# EAGLE design kicker-v2.1 (EAGLE 6.5.0)
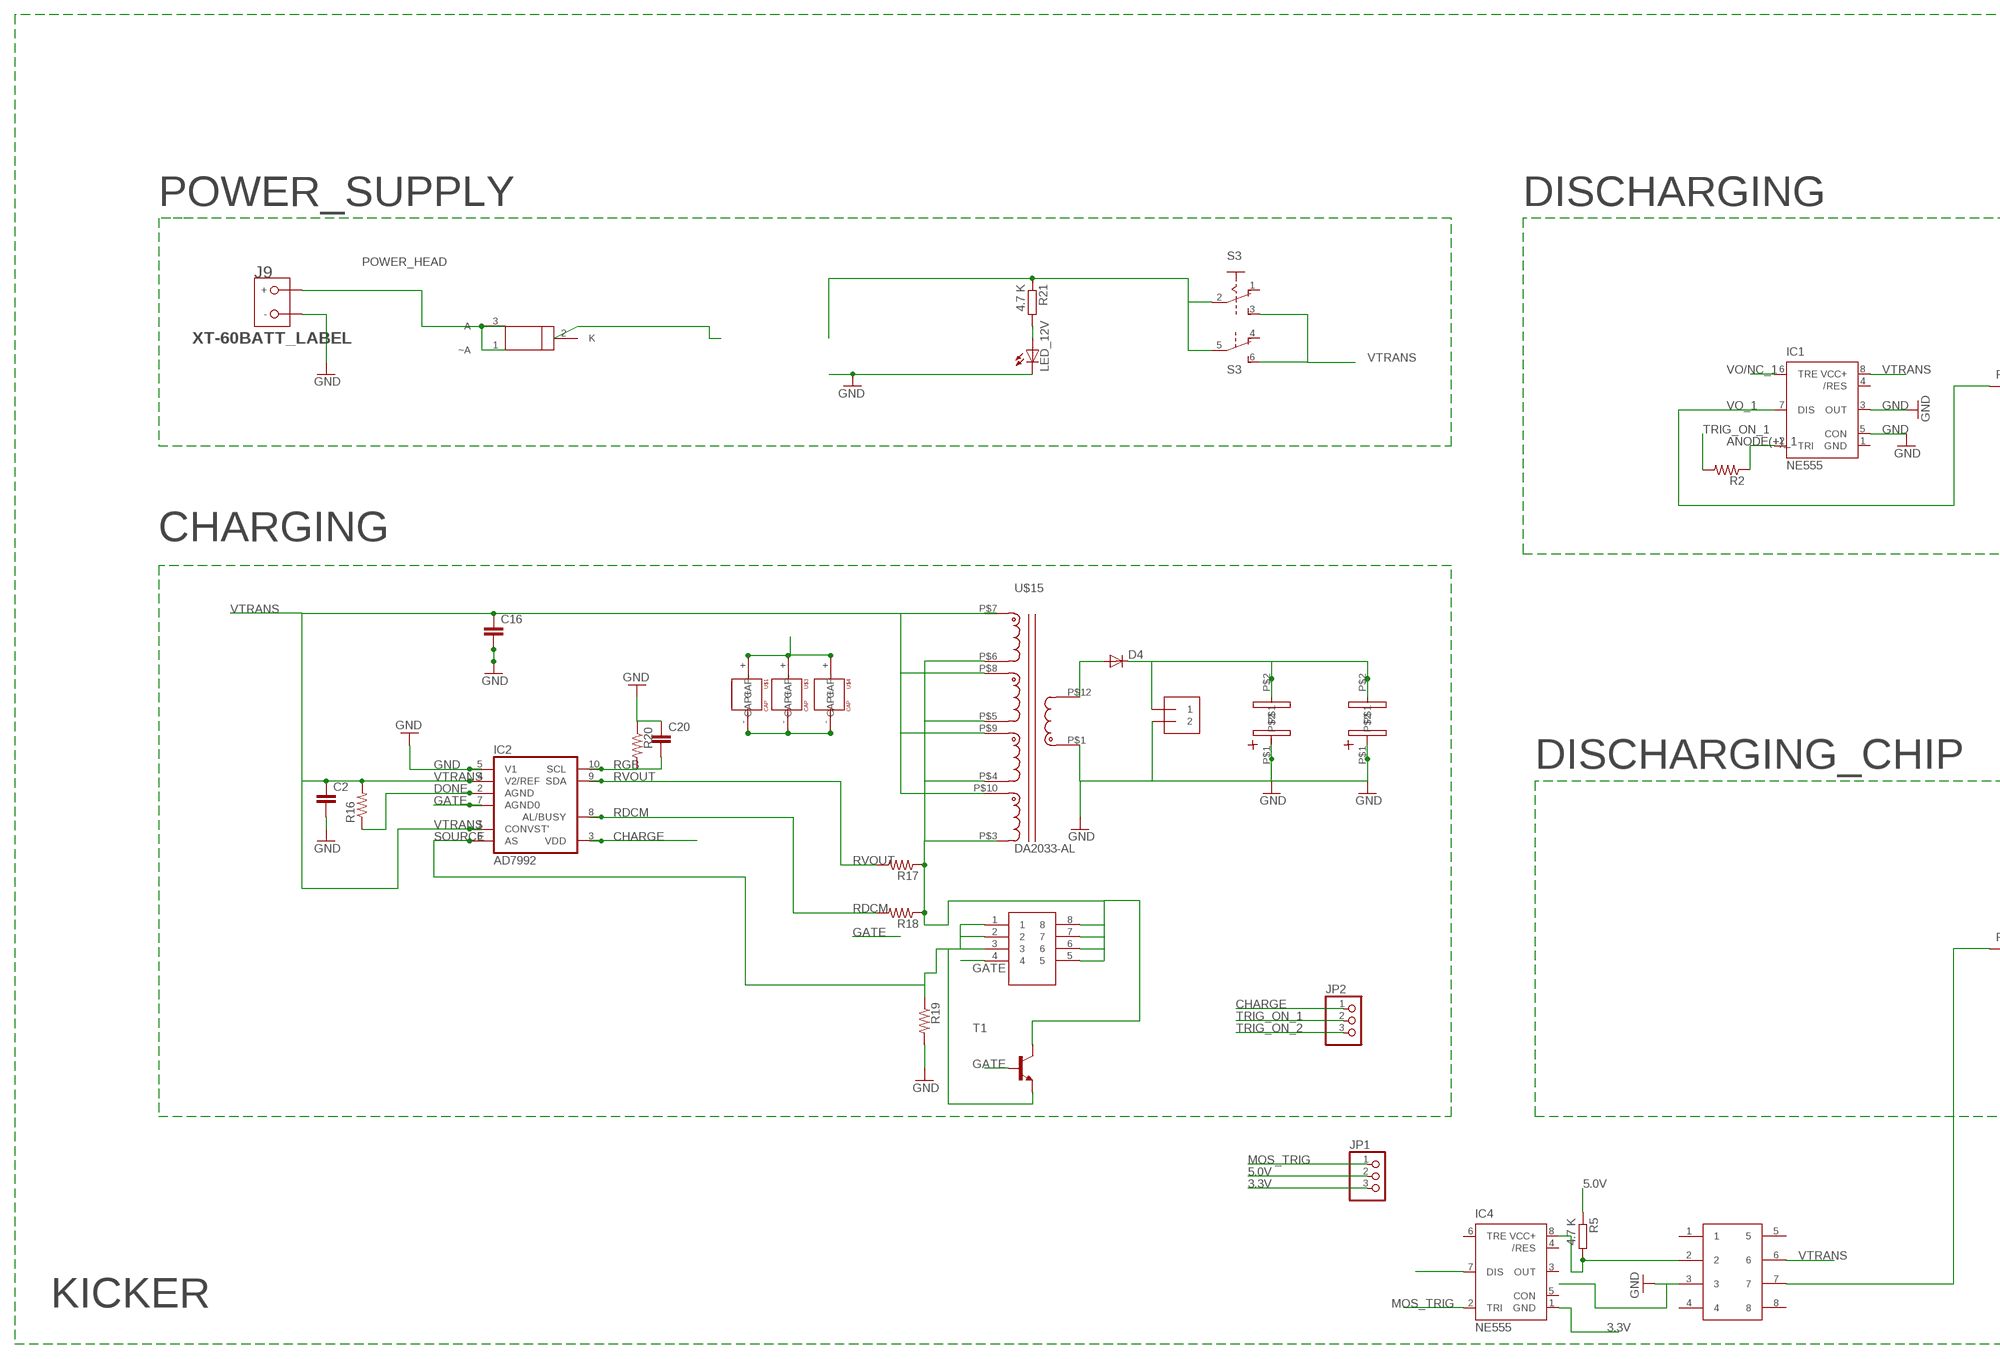
[diagram p0: schematic, sheet 1, part 1 of 2]
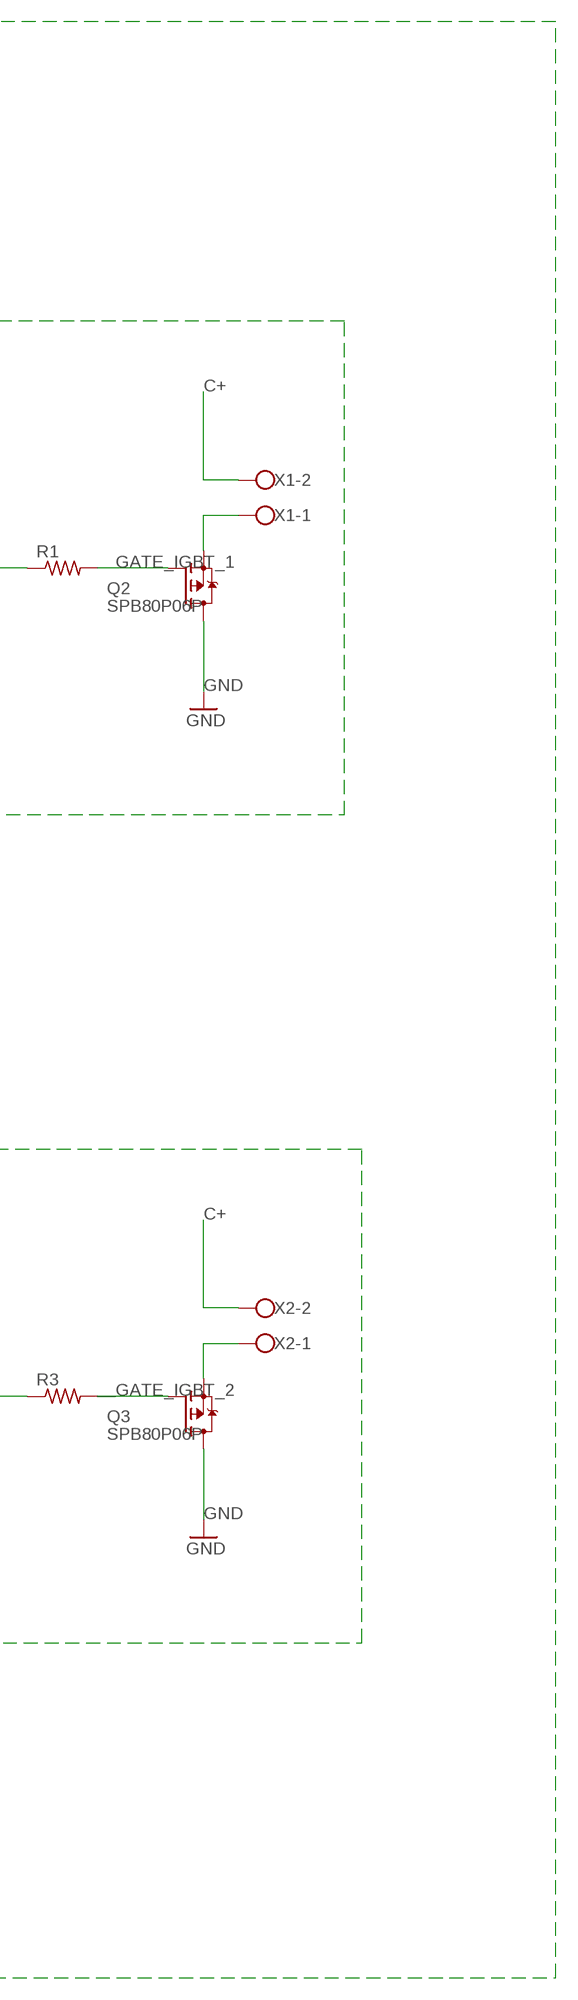
[diagram p1: schematic, sheet 1, part 2 of 2]

## Parts
C2  C-EUC1206  [C1206]
C16  C-EUC1206  [C1206]
C20  C-EUC1206  [C1206]
D4  DIODE-DO214AA  [DO214AA]
IC1  NE555  [DIL-08]
IC2  AD7992  [MSOP10]
IC4  NE555  [DIL-08]
J8  1X2-3.5MM  [1X2-3.5MM]
J9  XT-60BATT_LABEL  [XT-60]
JP1  PINHD-1X3  [1X03]
JP2  PINHD-1X3  [1X03]
LED_12V  LEDSML1206  [SML1206]
Q2  SPB80P06P  [TO263]
Q3  SPB80P06P  [TO263]
R1  R-US_R1206  [R1206]
R2  R-US_R1206  [R1206]
R3  R-US_R1206  [R1206]
R5  4.7 K  R-EU_0207/10  [0207/10]
R16  R-US_R1206  [R1206]
R17  R-US_R1206  [R1206]
R18  R-US_R1206  [R1206]
R19  R-US_R1206  [R1206]
R20  R-US_R1206  [R1206]
R21  4.7 K  R-EU_0207/10  [0207/10]
S3  A68-A31  [A68-A31]
T1  -NPN-SOT223  [SOT223]
U1  LP38690DT-3.3  [TO228P1042X238-3N]
U$1  CAP  [SVP_F12]
U$2  CAPS  [CAP]
U$3  CAP  [SVP_F12]
U$4  CAP  [SVP_F12]
U$5  MOSFET-LT3750  [SON-8]
U$6  TC4426A  [SOIC-8]
U$15  DA2033-AL  [DA2033-AL]
U$17  CAPS  [CAP]
X1  W237-102  [W237-102]
X2  W237-102  [W237-102]

## Nets
3.3V: IC4.1(GND) JP1.3
5.0V: JP1.2 R5.1
ANODE(+)_1: IC1.2(TRI) R2.1
C+: D4.C J8.1 U$2.P$2 U$17.P$2 X1.2 X2.2
CHARGE: IC2.3(VDD) JP2.1
DONE: IC2.2(AGND) R16.1
GATE: IC2.7(AGND0) T1.1(B) U$5.4
GATE_IGBT_1: Q2.1(G) R1.2
GATE_IGBT_2: Q3.1(G) R3.2
GND: C2.2 C16.2 C20.1 IC1.3(OUT) IC1.5(CON) IC2.5(V1) J8.2 J9.GND(-) LED_12V.C Q2.3(D) Q3.3(D) R19.2 R20.1 U$1.-(CAP-) U$2.P$1 U$3.-(CAP-) U$4.-(CAP-) U$15.P$1 U$17.P$1
MOS_TRIG: IC4.2(TRI) JP1.1
N$1: Q2.2(S) X1.1
N$2: Q3.2(S) X2.1
N$3: R17.1 R18.1 T1.4(C) U$5.5 U$5.6 U$5.7 U$5.8 U$15.P$3 U$15.P$4 U$15.P$5 U$15.P$6
N$4: IC4.8(VCC+) R5.2 U$6.2
N$28: D4.A U$15.P$12
N$29: LED_12V.A R21.2
PIN3: IC4.7(DIS) U$6.3 ; supply symbol labelled GND
POWER_HEAD: J9.BATT(+) U1.1(~A) U1.3(A)
RDCM: IC2.8(AL/BUSY) R18.2
RGB: C20.2 IC2.10(SCL) R20.2
RVOUT: IC2.9(SDA) R17.2
SOURCE: IC2.6(AS) R19.1 T1.3(E) U$5.1 U$5.2 U$5.3
SUPP_+: R21.1 S3.2(A:P) S3.5(B:P) U1.2(K)
TRIG_ON_1: JP2.2 R2.2
TRIG_ON_2: JP2.3
VO/NC_1: IC1.6(TRE)
VO_1: IC1.7(DIS) R1.1
VO_2: R3.1 U$6.7
VTRANS: C2.1 C16.1 IC1.8(VCC+) IC2.1(CONVST') IC2.4(V2/REF) R16.2 S3.3(A:S) S3.6(B:S) U$1.+(CAP+) U$3.+(CAP+) U$4.+(CAP+) U$6.6 U$15.P$7 U$15.P$8 U$15.P$9 U$15.P$10
Unconnected: IC1.4(/RES) IC4.3(OUT) IC4.4(/RES) IC4.5(CON) IC4.6(TRE) S3.1(A:O) S3.4(B:O) U$6.1 U$6.4 U$6.5 U$6.8

## Power pins joined to a net without a drawn wire
GND: IC1.1(GND)

## Library data of the parts
C2 C16 C20 = rcl:C-EU: CAPACITOR, European symbol
D4 = diode:DIODE-: DIODE
IC1 IC4 = st-microelectronics:NE555: General purpose bipolar Timer; MF: Arrow Electronics; MPN: NE555N; OC_FARNELL: 1467742; OC_NEWARK: 89K1486
IC2 = analog_devices_gaui:AD7992: 16-Bit DAC with Serial Data Interface
J8 = adafruit:1X2: 3.5mm Terminal block http://www.ladyada.net/library/pcb/eaglelibrary.html
J9 = RoboJackets-Connectors:XT-60: XT-60 Power Connector Distributor: HobbyKing <http://www.hobbyking.com/hobbyking/store/RC_PRODUCT_SEARCH.asp?strSearch=xt-60>
JP1 JP2 = adafruit:PINHD-1X3: PIN HEADER
LED_12V = led:LED: LED OSRAM: - CHIPLED LG R971, LG N971, LY N971, LG Q971, LY Q971, LO R971, LY R971 LH N974, LH R974 LS Q976, LO Q976, LY Q976 LO Q996 - Hyper CHIPLED LW Q18S LB Q993, LB Q99A, LB R99A - SideLED LS A670, LO A670, LY A670, LG A670, LP A670 LB A673, LV A673, LT A673, LW A673 LH A674 LY A675 LS A676, LA A676, LO A676, LY A676, LW A676 LS A679, LY A679, LG A679 - Hyper Micro SIDELED® LS Y876, LA Y876, LO Y876, LY Y876 LT Y87S - SmartLED LW L88C, LW L88S LB L89C, LB L89S, LG L890 LS L89K, LO L89K, LY L89K LS L896, LA L896, LO L896, LY L896 - TOPLED LS T670, LO T670, LY T670, LG T670, LP T670 LSG T670, LSP T670, LSY T670, LOP T670, LYG T670 LG T671, LOG T671, LSG T671 LB T673, LV T673, LT T673, LW T673 LH T674 LS T676, LA T676, LO T676, LY T676, LB T676, LH T676, LSB T676, LW T676 LB T67C, LV T67C, LT T67C, LS T67K, LO T67K, LY T67K, LW E67C LS E67B, LA E67B, LO E67B, LY E67B, LB E67C, LV E67C, LT E67C LW T67C LS T679, LY T679, LG T679 LS T770, LO T770, LY T770, LG T770, LP T770 LB T773, LV T773, LT T773, LW T773 LH T774 LS E675, LA E675, LY E675, LS T675 LS T776, LA T776, LO T776, LY T776, LB T776 LHGB T686 LT T68C, LB T68C - Hyper Mini TOPLED® LB M676 - Mini TOPLED Santana® LG M470 LS M47K, LO M47K, LY M47K Source: http://www.osram.convergy.de LUXEON: - LUMILED® LXK2-PW12-R00, LXK2-PW12-S00, LXK2-PW14-U00, LXK2-PW14-V00 LXK2-PM12-R00, LXK2-PM12-S00, LXK2-PM14-U00 LXK2-PE12-Q00, LXK2-PE12-R00, LXK2-PE12-S00, LXK2-PE14-T00, LXK2-PE14-U00 LXK2-PB12-K00, LXK2-PB12-L00, LXK2-PB12-M00, LXK2-PB14-N00, LXK2-PB14-P00, LXK2-PB14-Q00 LXK2-PR12-L00, LXK2-PR12-M00, LXK2-PR14-Q00, LXK2-PR14-R00 LXK2-PD12-Q00, LXK2-PD12-R00, LXK2-PD12-S00 LXK2-PH12-R00, LXK2-PH12-S00 LXK2-PL12-P00, LXK2-PL12-Q00, LXK2-PL12-R00 Source: www.luxeon.com KINGBRIGHT: KA-3528ASYC Source: www.kingbright.com
Q2 Q3 = transistor-fet:SPB80P06P: SIPMOS (R) Power-Transistor P-Channel, Enhancement mode Source: http://www.infineon.com/upload/Document/cmc_upload/documents/011/3685/SPP80P06P.pdf
R1-R3 R16-R18 R20 = adafruit:R-US_: RESISTOR, American symbol
R5 R21 = resistor:R-EU_: RESISTOR, European symbol
R19 = resistor:R-US_: RESISTOR, American symbol
S3 = switch:A68-A31: SLIDING SWITCH Siemens, distributor Buerklin, 11G766
T1 = transistor-neu-to92:*-NPN-: NPN Transistror
U1 = LP38690DT-3.3:LP38690DT-3.3; MPN: LP38690DT-3.3; OC_FARNELL: 1008048; OC_NEWARK: 41K7439; PACKAGE: TO-252; SUPPLIER: National Semiconductor
U$1 U$3 U$4 = SVP_F12:CAP
U$2 U$17 = Electrolytic-Cap:CAPS
U$5 = SON-8:MOSFET-LT3750
U$6 = smd-footprints:TC4426A
U$15 = inductor-coilcraft-2:DA2033-AL: Flyback Transformer for Linear Technology LT3750 Reference: http://www.coilcraft.com/da2032.cfm L - 10 uH TurnsRatio Pri:Sec - 1:10 Ipeak - 5.0 A Interwinding capacitance - 76 pF DCRmax: Pri - 0.015, Sec - 1.10 Ohms
X1 X2 = con-wago-500:W237-102: WAGO SCREW CLAMP; MPN: 237-102; OC_FARNELL: unknown; OC_NEWARK: 70K9898

## Board
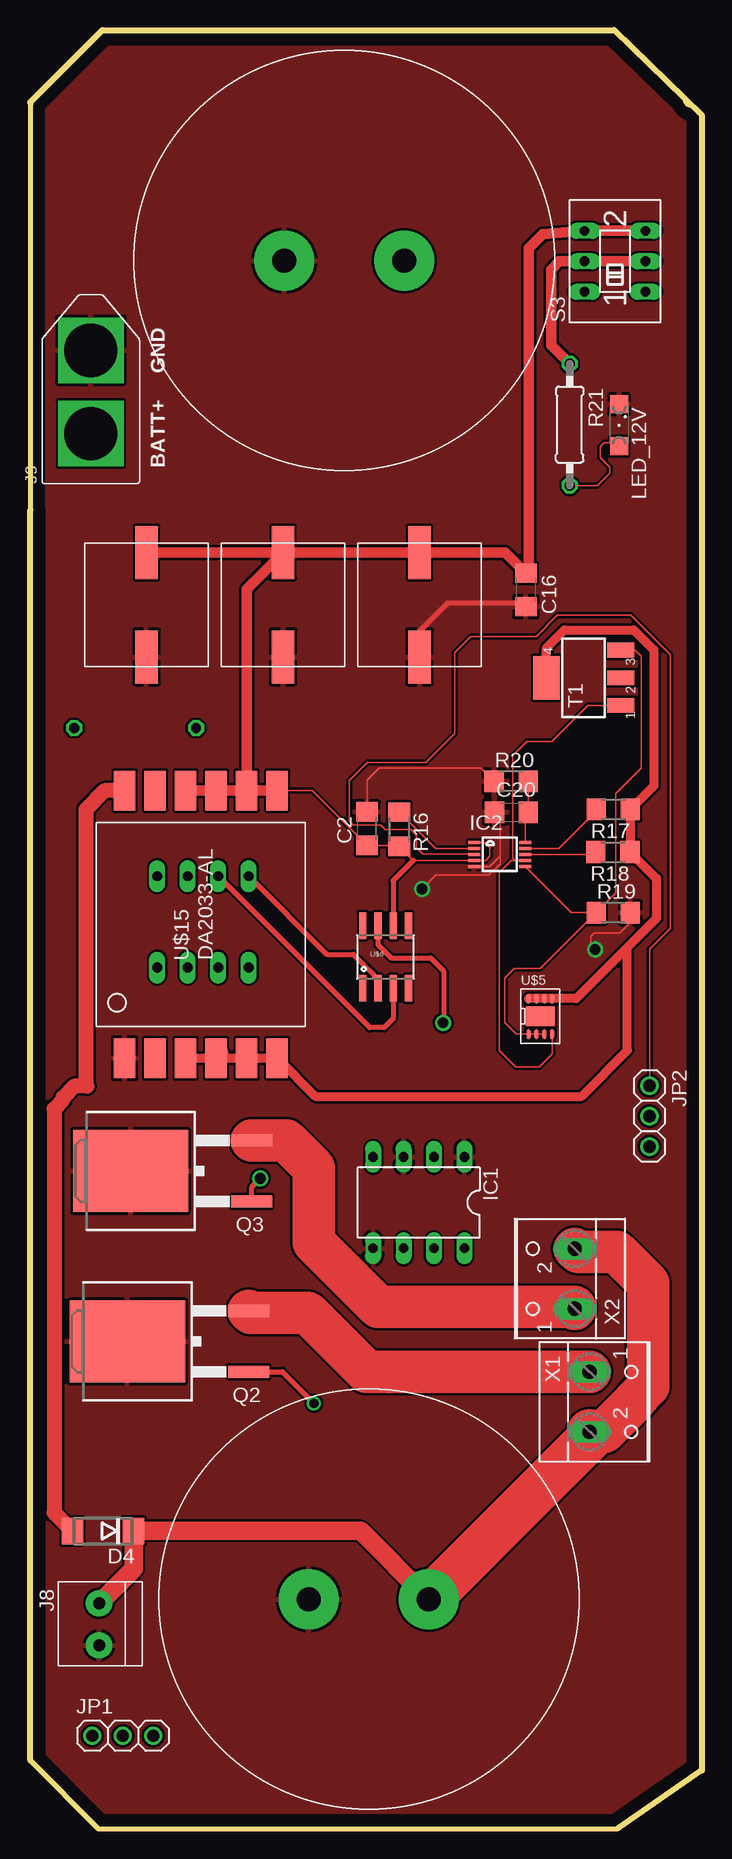
[diagram p2: board, top side]
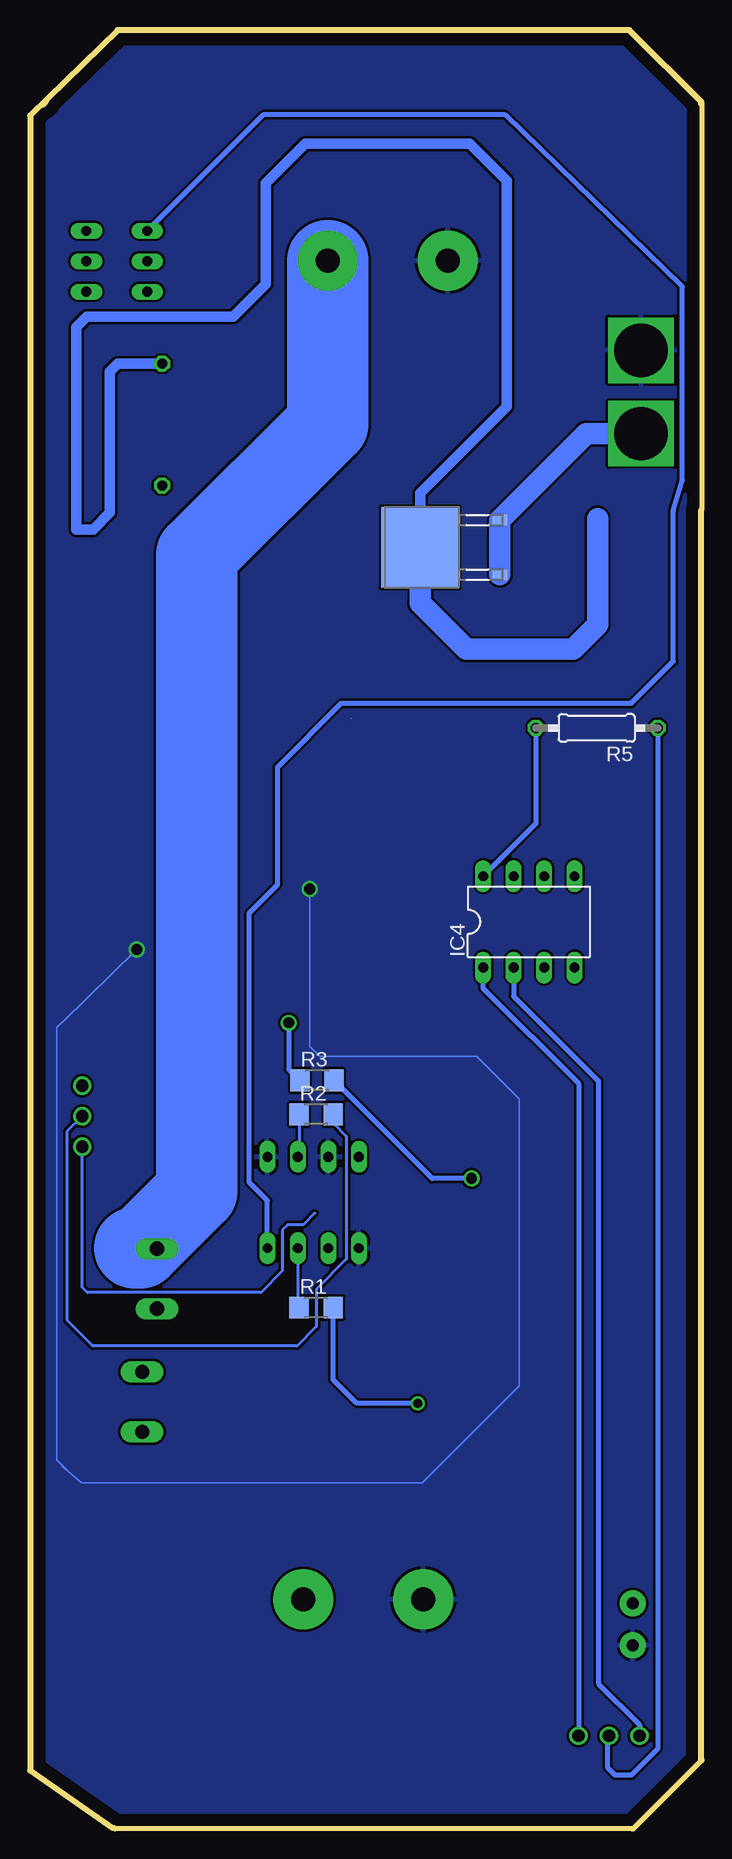
[diagram p3: board, bottom side, seen from below]

Size 55.99 x 149.95 mm. Coordinates in mm from the lower left corner, seen from the top.
Outline: 0.1,143.8 0.1,143.9
Outline: 0,5.8 0,5.7 5.7,0
Outline: 5.8,0 48.9,0 49,0.1
Outline: 0.02,143.84 0.02,110
Outline: 54.91,143.69 54.62,143.98
Outline: 0.01,143.92 6.03,149.95 48.68,149.95 55.99,142.83 55.99,4.87 49.03,0.06
Outline: 0.04,5.71 0.04,109.95
Copper layers (1*16): Top 0.45mm / dielectric 1.5mm / Bottom 0.25mm
Design rules "default *": minimum track width 10mil, minimum drill 24mil, track to track 8mil, track to pad 8mil, pad to pad 8mil, via to via 8mil, smd to smd 8mil, copper to edge 40mil, drill to drill 8mil, minimum pad ring 10mil, minimum via ring 8mil, stop-mask expansion 4mil, vias tented up to drill 0mil, thermal gap 10mil

### Footprints (pad centres in the part's own frame; a part is rotated, then mirrored left to right if it is on the bottom)
C1206 = smd 1.6 x 1.8: 1 -1.4,0; 2 1.4,0
DO214AA = smd 1.8 x 2.2: A 2.55,0; C -2.55,0
DIL-08 = drill 0.813 long: 1 -3.81,-3.81; 2 -1.27,-3.81; 3 1.27,-3.81; 4 3.81,-3.81; 5 3.81,3.81; 6 1.27,3.81; 7 -1.27,3.81; 8 -3.81,3.81
MSOP10 = smd 0.25 x 1: 1 -1,-2.113; 2 -0.5,-2.113; 3 0,-2.113; 4 0.5,-2.113; 5 1,-2.113; 6 1,2.113; 7 0.5,2.113; 8 0,2.113; 9 -0.5,2.113; 10 -1,2.113
1X2-3.5MM = drill 1 pad 2.184: 1 1.8,0; 2 -1.7,0
XT-60 = drill 4.446 square: BATT 0,4.154; GND 0,11.092
1X03 = drill 1.016: 1 -2.54,0; 2 0,0; 3 2.54,0
SML1206 = smd 1.5 x 1.5: A 1.75,0; C -1.75,0
TO263 = smd 1 x 3.4: 1 -2.54,-6.6; 2 2.54,-6.6 | smd 6.8 x 9.6: 3 0,3.5
R1206 = smd 1.6 x 1.803: 1 -1.422,0; 2 1.422,0
0207/10 = drill 0.813 octagon: 1 -5.08,0; 2 5.08,0
A68-A31 = drill 0.813 long: 1 -2.54,-2.54; 2 0,-2.54; 3 2.54,-2.54; 4 -2.54,2.54; 5 0,2.54; 6 2.54,2.54
SOT223 = smd 1.219 x 2.235: 1 -2.311,-3.099; 2 0,-3.099; 3 2.311,-3.099 | smd 3.6 x 2.2: 4 0,3.099
TO228P1042X238-3N = smd 0.889 x 1.219: 1 -2.286,-6.502; 3 2.286,-6.502 | smd 6.731 x 6.502: 2 0,0.152
SVP_F12 = smd 1.9 x 4.4: + 5.15,-0.8; - 5.15,-9.5
CAP = drill 2 pad 5: P$1 -5,0; P$2 5,0
SON-8 = smd 0.35 x 0.85: 1 -0.975,-1.475; 2 -0.325,-1.475; 3 0.325,-1.475; 4 0.975,-1.475; 5 0.975,1.475; 6 0.325,1.475; 7 -0.325,1.475; 8 -0.975,1.475 | smd 2.4 x 1.65: PAD 0,0
SOIC-8 = smd 0.61 x 2.21: 1 -1.905,-2.616; 2 -0.635,-2.616; 3 0.635,-2.616; 4 1.905,-2.616; 5 1.905,2.616; 6 0.635,2.616; 7 -0.635,2.616; 8 -1.905,2.616
DA2033-AL = smd 3.3 x 1.79: P$1 -11.15,6.35; P$2 -11.15,3.81; P$3 -11.15,1.27; P$4 -11.15,-1.27; P$5 -11.15,-3.81; P$6 -11.15,-6.35; P$7 11.15,-6.35; P$8 11.15,-3.81; P$9 11.15,-1.27; P$10 11.15,1.27; P$11 11.15,3.81; P$12 11.15,6.35
W237-102 = drill 1.194 long: 1 -2.5,-1.27; 2 2.5,-1.27

### Placement (x,y rotation side)
C2  28.08,83.39 90 top
C16  41.33,103.28 270 top
C20  40.11,84.74 0 top
D4  6.08,24.83 180 top
IC1  32.4,52.21 180 top
IC2  39.15,81.23 270 top
IC4  14.41,75.61 0 bottom
J8  5.75,17 90 top
J9  5.06,112.15 0 top
JP1  7.73,7.77 0 top
JP2  51.63,59.41 270 top
LED_12V  49.09,117 270 top
Q2  11.62,40.64 90 top
Q3  11.89,54.85 90 top
R1  32.14,43.45 0 bottom
R2  32.14,59.56 0 bottom
R3  32.07,62.39 0 bottom
R5  8.76,91.77 180 bottom
R16  30.77,83.33 270 top
R17  48.61,84.99 180 top
R18  48.57,81.43 180 top
R19  48.61,76.38 0 top
R20  40.1,87.33 0 top
R21  44.97,117.05 270 top
S3  48.75,130.67 90 top
T1  46.13,95.95 90 top
U1  23.33,106.83 90 bottom
U$1  27.32,107.19 0 top
U$2  28.23,19.14 0 top
U$3  15.93,107.19 0 top
U$4  4.55,107.19 0 top
U$5  42.53,67.73 0 top
U$6  29.63,72.68 0 top
U$15  14.24,75.39 90 top
U$17  26.19,130.73 0 top
X1  47.9,35.6 270 top
X2  44.12,45.86 90 top

### Tracks (layer width: path | path; a pad name or v marks a point on that pad's centre or on a via)
3.3V
  Bottom 0.406: JP1.3 10.23,7.81 10.23,62.08 18.22,70.07 IC4.1
5.0V
  Bottom 0.406: R5.1 3.68,6.66 5.87,4.48 7.22,4.48 7.84,5.09 7.84,7.66 JP1.2
ANODE(+)_1
  Bottom 0.254: R2.1 33.56,56.12 IC1.2
C+
  Top 1.524: J8.1 8.63,21.68 D4.C 27.55,24.83 U$2.P$2
  Top 3.556: X1.2 47.86,33.1 50.39,35.62 50.39,35.74 51.53,36.88 51.53,45.46 48.91,48.07 45.68,48.07 X2.2
  Top 3.81: U$2.P$2 46.63,32.54 X1.2
  Bottom 3.81: 47.26,48.44 X2.2
  Bottom 6.807: 47.26,48.44 46.78,48.44 42.08,53.15 42.08,106.2 31.19,117.09 U$17.P$2
CHARGE
  Top 0.127: JP2.1 51.63,73.34 53.35,75.06 53.35,97.88 50.07,101.16 43.96,101.16 42.18,99.38 36.71,99.38 35.39,98.06 35.39,91.32 32.97,88.91 28.09,88.91 26.59,87.4 26.59,84 26.92,83.67 29.23,83.67 29.6,83.3 31.74,83.3 32.2,82.85 32.2,81.8 32.75,81.25 37.01,81.25 IC2.3
DONE
  Top 0.127: R16.1 33.8,81.73 IC2.2
GATE
  Top 0.127: 40.4,80.73 40.09,80.73 39.09,79.73 39.09,64.89 40.48,63.5 42.43,63.5 43.51,64.58 U$5.4 | 40.4,80.73 IC2.7 | T1.1 46.49,93.64 43.49,90.65 41.39,90.65 40.21,89.47 40.21,80.92 40.4,80.73
GATE_IGBT_1  (via drill 0.76)
  Top 0.406: Q2.1 21.04,38.1 v23.66,35.47
  Bottom 0.406: v23.66,35.47 28.75,35.47 30.73,37.45 R1.2
GATE_IGBT_2  (via drill 0.89)
  Top 0.406: Q3.1 18.49,53.51 v19.19,54.22
  Bottom 0.406: v19.19,54.22 22.48,54.22 R3.2
GND  (via drill 0.89)
  Top 0.127: C2.2 28.08,87.41 29.12,88.44 37.56,88.44 R20.1 | IC2.5 38.3,80.23 39.19,81.11 | 39.19,81.11 39.19,84.27 C20.1 | 39.19,81.11 39.19,80.44 38.25,79.5 33.83,79.5 v32.67,78.35 | v47.1,73.3 46.75,73.65 46.75,74.41 47.04,74.69 49.15,74.69 50.03,75.56 R19.2 | 32.38,97.61 U$1.-
  Top 0.406: U$1.- 32.47,99.84 34.83,102.2 41,102.2 C16.2
  Bottom 0.127: v32.67,78.35 32.62,78.35 32.67,78.3 32.67,65.23 31.82,64.38 18.78,64.38 15.23,60.84 15.23,36.92 23.3,28.85 51.69,28.85 52.78,29.79 | 52.78,29.79 53.28,30.23 | v47.1,73.3 53.26,67.27 53.3,67.27 53.76,66.81 53.76,30.77 52.78,29.79 | 29.23,92.56 29.22,92.56
  pour Bottom: -12.81,157.25 -12.81,-7.98 67.45,-7.98 67.45,157.29
  pour Top: -12.72,156.65 -12.72,-9 68.38,-9 68.38,-1.76 68.38,158.31
MOS_TRIG
  Bottom 0.406: IC4.2 15.68,69.4 8.63,62.35 8.63,12.1 5.19,8.66 JP1.1
N$1
  Top 3.556: X1.1 28.05,38.1 23.13,43.02 18.38,43.02 Q2.2
N$2
  Top 3.556: Q3.2 21.36,57.39 23.65,55.09 23.65,48.87 29.01,43.51 45.39,43.51 X2.1
N$3
  Top 0.762: 15.76,64.69 15.31,64.24 U$15.P$3 U$15.P$4 U$15.P$5 U$15.P$6 23.77,61.06 45.96,61.06 49.79,64.89 49.79,73.48 | U$5.5 U$5.6 | U$5.5 U$5.7 U$5.8 | T1.4 43.03,98.45 44.53,99.94 50.31,99.94 51.99,98.27 51.99,86.95 R17.1 50.03,81.46 R18.1 52.19,79.22 52.19,75.89 49.79,73.48 | 49.79,73.48 45.52,69.21 U$5.5
  Top 1.524: 15.76,64.69 15.76,64.49 U$15.P$4
N$4
  Top 0.406: IC4.8 24.73,72.9 26.94,72.9 27.74,72.1 28.67,71.17 28.67,71 28.99,70.67 U$6.2
  Bottom 0.406: R5.2 13.84,83.8 IC4.8
N$28
  Top 1.27: U$15.P$12 6.2,86.54 4.65,84.99 4.65,62.02 4.74,61.92 3.7,61.92 2.76,60.98 2.76,60.79 2,60.03 2,26.35 D4.A
N$29
  Top 0.127: R21.2 47.27,111.97 48.32,113.02 48.32,113.52 47.53,114.31 47.53,115.22 47.87,115.57 48.78,115.57 LED_12V.A
PIN3
  Top 0.406: U$6.3 30.26,67.55 29.5,66.79 28.31,66.79 IC4.7
POWER_HEAD
  Bottom 0.406: U1.3
  Bottom 1.778: U1.1 U1.3 9.64,116.31 J9.BATT
RDCM
  Top 0.127: IC2.8 46.95,81.23 R18.2
RGB
  Top 0.127: R20.2 C20.2 41.26,84.49 IC2.10
RVOUT
  Top 0.127: IC2.9 44.07,81.73 46.61,84.27 46.61,84.41 R17.2
SOURCE
  Top 0.127: R19.1 42.54,71.73 40.36,71.73 39.55,70.92 39.55,67.23 40.52,66.26 U$5.1 U$5.2 U$5.3 | IC2.6 45.11,76.38 R19.1 | T1.3 50.42,98.27 50.92,97.76 50.92,88.41 48.83,86.31 48.83,78.02 R19.1
SUPP_+
  Top 0.889: S3.5 S3.2 44.11,130.67 43.43,129.99 43.43,123.68 R21.1
  Bottom 0.889: U1.2 23.48,111.35 16.27,118.56 16.27,137.4 19.33,140.46 33.06,140.46 36.35,137.17 36.35,128.77 39.07,126.05 51.25,126.05 52.13,125.17 52.13,108.32 50.72,108.32 49.34,109.71 49.34,121.47 48.67,122.13 R21.1
  Bottom 1.778: U1.2 23.48,102.17 19.65,98.33 10.72,98.33 8.69,100.37 8.69,109.24
TRIG_ON_1
  Bottom 0.254: R2.2 30.72,58.83 29.62,57.73 29.62,47.49 32.13,44.98 32.13,41.87 33.77,40.23 33.78,40.25 50.74,40.25 52.92,42.43 52.92,58.12 JP2.2
TRIG_ON_2
  Bottom 0.254: 52.06,56.87 JP2.3 51.63,45.13 51.2,44.7 36.78,44.7 36.77,44.69 34.95,46.52 34.95,49.92 34.51,50.36 33.22,50.36 32.24,51.34
VO_1
  Bottom 0.127: 33.66,43.55 R1.1
  Bottom 0.254: IC1.7 33.66,43.55
VO_2  (via drill 0.89)
  Top 0.406: U$6.7 28.99,73.72 30.1,72.61 33.38,72.61 34.48,71.51 34.48,67.25 v34.42,67.19
  Bottom 0.406: v34.42,67.19 34.42,63.32 R3.1
VTRANS
  Top 0.127: U$15.P$7 23.53,86.54 C2.1 30.7,81.99 R16.2 31.96,80.73 IC2.4 37.98,80.73 38.33,81.08 38.33,81.73 38.34,81.75 37.85,82.23 IC2.1
  Top 0.406: 31.96,80.73 30.26,79.04 U$6.6 | 41.55,105.55 41.33,105.55 C16.1
  Top 0.889: 41.55,105.55 41.55,131.74 42.73,132.93 S3.6 S3.3 | U$15.P$10 U$15.P$9 U$15.P$8 | U$15.P$8 U$15.P$7 | C16.1 39.62,106.39 U$1.+ U$3.+ | U$3.+ U$4.+ | U$3.+ 18.05,103.35 U$15.P$8
  Bottom 0.406: IC1.8 36.2,52.38 37.7,53.87 37.7,76.35 35.36,78.7 35.36,88.53 30.06,93.83 5.87,93.83 2.37,97.33 2.37,109.88 1.62,112.4 1.62,128.54 16.38,142.89 36.53,142.89 S3.6